# Altium schematic sheet PCB_V2.SchDoc
size A4; SheetNumber: 1; SheetTotal: 1
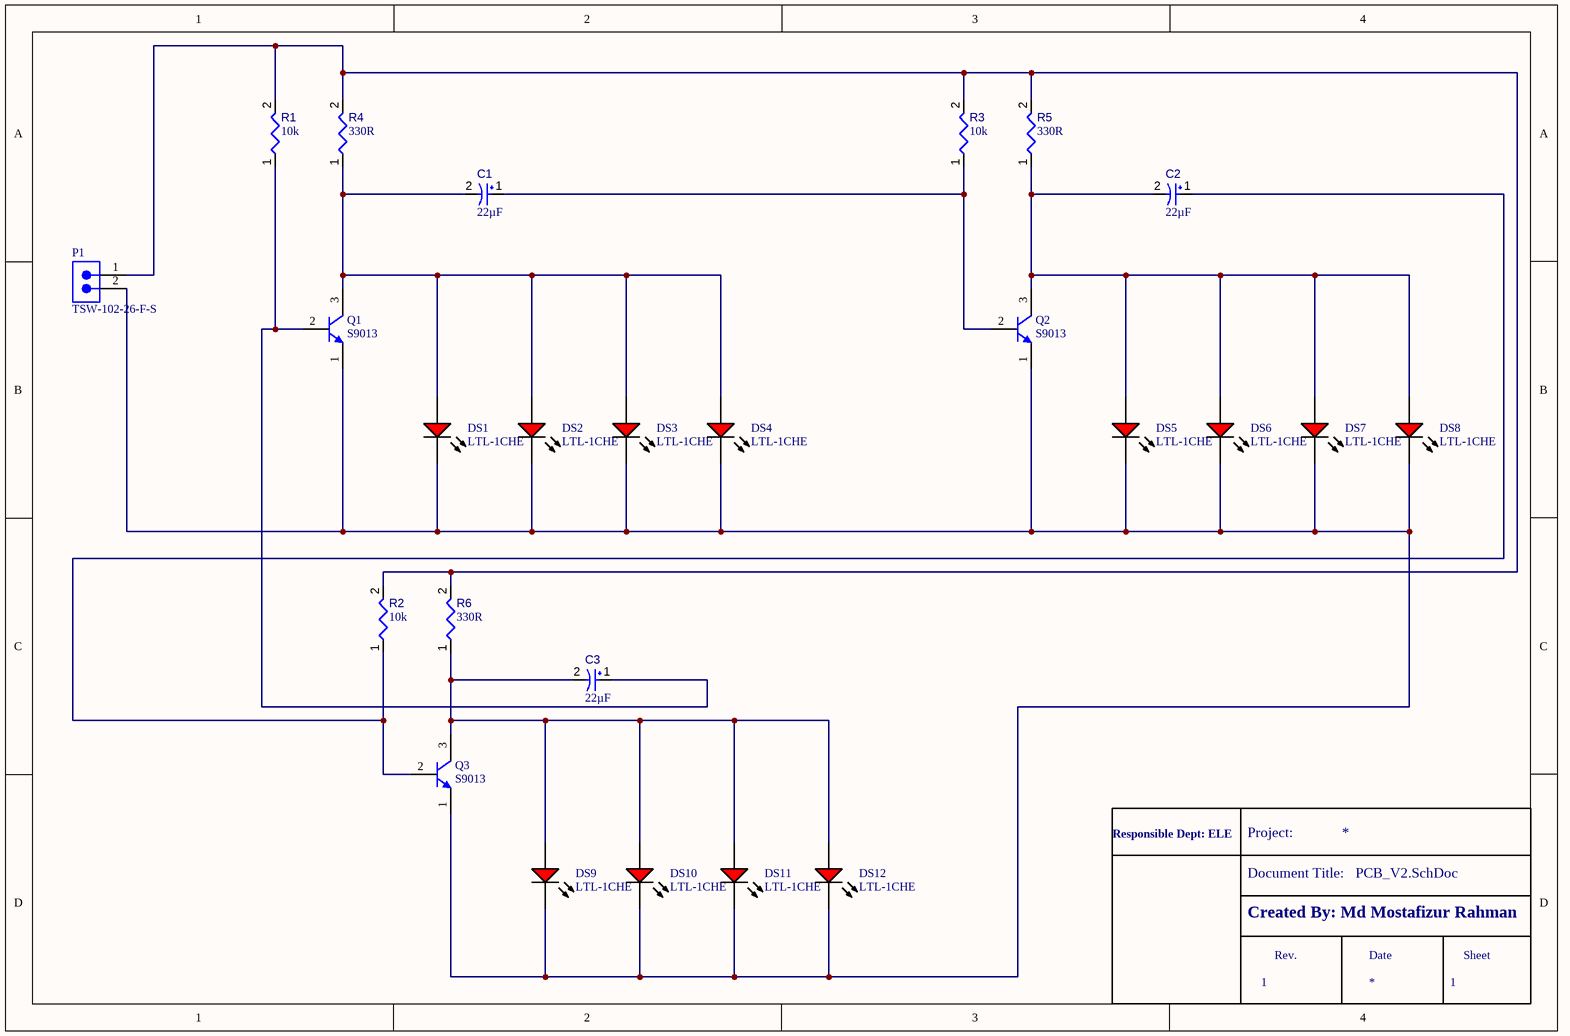
[diagram p0: PCB_V2.SchDoc]

## Parts
*  HSHL Title Block  (value not drawn)  (graphical)
C1  value 22µF  [CAPPR55-200-1100X500X1200]  (hidden comment: ECA1HM220)
C2  value 22µF  [CAPPR55-200-1100X500X1200]  (hidden comment: ECA1HM220)
C3  value 22µF  [CAPPR55-200-1100X500X1200]  (hidden comment: ECA1HM220)
DS1  LTL-1CHE  [INDPR60-254-520X380X650]
DS2  LTL-1CHE  [INDPR60-254-520X380X650]
DS3  LTL-1CHE  [INDPR60-254-520X380X650]
DS4  LTL-1CHE  [INDPR60-254-520X380X650]
DS5  LTL-1CHE  [INDPR60-254-520X380X650]
DS6  LTL-1CHE  [INDPR60-254-520X380X650]
DS7  LTL-1CHE  [INDPR60-254-520X380X650]
DS8  LTL-1CHE  [INDPR60-254-520X380X650]
DS9  LTL-1CHE  [INDPR60-254-520X380X650]
DS10  LTL-1CHE  [INDPR60-254-520X380X650]
DS11  LTL-1CHE  [INDPR60-254-520X380X650]
DS12  LTL-1CHE  [INDPR60-254-520X380X650]
P1  TSW-102-26-F-S  [SMTC-TSW-102-26-XX-S]
Q1  S9013  [JSCJ-TO-92-3_V]
Q2  S9013  [JSCJ-TO-92-3_V]
Q3  S9013  [JSCJ-TO-92-3_V]
R1  value 10k  [RESA60-630X240]  (hidden comment: MFR-25FBF52-10K)
R2  value 10k  [RESA60-630X240]  (hidden comment: MFR-25FBF52-10K)
R3  value 10k  [RESA60-630X240]  (hidden comment: MFR-25FBF52-10K)
R4  value 330R  [RESA60-630X240]  (hidden comment: MFR-25FBF52-10K)
R5  value 330R  [RESA60-630X240]
R6  330R  [RESA60-630X240]

## Nets
NetC1_1: C1.1 Q2.2(B) R3.1
NetC1_2: C1.2 DS1.1(A) DS2.1(A) DS3.1(A) DS4.1(A) Q1.3(C) R4.1
NetC2_1: C2.1 Q3.2(B) R2.1
NetC2_2: C2.2 DS5.1(A) DS6.1(A) DS7.1(A) DS8.1(A) Q2.3(C) R5.1
NetC3_1: C3.1 Q1.2(B) R1.1
NetC3_2: C3.2 DS9.1(A) DS10.1(A) DS11.1(A) DS12.1(A) Q3.3(C) R6.1
NetDS1_2: DS1.2(K) DS2.2(K) DS3.2(K) DS4.2(K) DS5.2(K) DS6.2(K) DS7.2(K) DS8.2(K) DS9.2(K) DS10.2(K) DS11.2(K) DS12.2(K) P1.2 Q1.1(E) Q2.1(E) Q3.1(E)
NetP1_1: P1.1 R1.2 R2.2 R3.2 R4.2 R5.2 R6.2

## Notes on the sheet
- (in symbol HSHL Title Block) Responsible Dept: ELE; Project:; Document Title:; Created By: Md Mostafizur Rahman; Rev.; Date; Sheet; 1

## Library data of the parts
C1-C3 = CMP-001-00027-7: Aluminum Electrolytic Capacitor, 22 uF, +/- 20%, 50 V, -40 to 85 degC, 2-Pin THD, RoHS, Bulk; Manufacturer: Panasonic; Ripple Current (AC): 100mA; Voltage Rating: 50V; Pins: 2; Case/Package: Radial; Datasheet Version: Rev. 05, 10/2016; RoHS Compliant: True; Max Operating Temperature: 85°C; Ripple Current: 100mA; Capacitor Type: Electrolytic; Mounting Technology: TH; Package Quantity: 200; Package Reference: CAPPR55-200-1100X500X1200; Package Description: 2-Pin Radial Lead, Dia 5 mm, Height 12 mm; Packaging: Bulk; Lead Pitch: 2mm; Min Operating Temperature: -40°C; Diameter: 5mm; Tolerance: 20%; Datasheet URL: https://industrial.panasonic.com/cdbs/www-data/pdf/RDF0000/ABA0000C1218.pdf; Manufacturer URL: http://www.panasonic.com/
DS1-DS12 = CMP-007-00018-2: LED Uni-Color Red, 100 mW, 30 mA, -55 to 100 degC, 2-Pin THD, RoHS, Bulk; Manufacturer: Lite-On; Forward Current: 20mA; Nominal Vf: 2V; Viewing Angle: 60degrees; Luminous Intensity: 12.6mcd; Lens Style: Dome; Pins: 2; RoHS Compliant: True; Package Reference: LTL-1CHE; Package Quantity: 1000; Mounting Technology: TH; Min Operating Temperature: -55°C; Colour: Red; Case/Package: Radial; Manufacturer URL: http://www.us.liteon.com/; Datasheet URL: https://datasheet.ciiva.com/15117/getdatasheetpartid-187746-15117985.pdf; Forward Voltage: 2V; Max Operating Temperature: 100°C; Illumination Colour: Red; Package Description: 2-Pin Through Hole Device, Dia 3.8 mm, Pitch 2.54 mm; Packaging: Bulk; Datasheet Version: Dec-03
P1 = CMP-1024-00329-1: 0.025" SQ Post Header, Through-hole, Vertical, -55 to 125 degC, 2.54 mm Pitch, 2-Pin, Male, RoHS; Manufacturer: Samtec; Pitch: 2.54 mm; PackageVersion: DM, 8/1988; ComponentLink2Description: Datasheet; PackageReference: TSW-102-26-XX-S; ComponentLink3URL: http://www.samtec.com/documents/webfiles/cpdf/TSW-XXX-XX-XXX-X-XX-XXX-MKT.pdf; ComponentLink2URL: http://www.samtec.com/documents/webfiles/pdf/TSW_TH.PDF; ComponentLink1Description: Manufacturer URL; DatasheetVersion: F-214; RoHS: True; ComponentLink3Description: Package Specification; PartNumber: TSW-102-26-F-S; Temperature Range: -55 to 125 degC; Orientation: Vertical; ComponentLink1URL: http://www.samtec.com; PackageDescription: .025[0.64] SQ. Post Terminal Strip Assembly; Mounting Technology: Through-hole
Q1-Q3 = CMP-013-00000-3: Transistor, NPN, 0.1 uA, 150 MHz, 3-Pin TO-92; Manufacturer: Jiangsu Changjiang Electronics Technology; Case/Package: TO-92-3; Datasheet URL: http://www.cj-elec.com/txUpfile/20121910315050632.pdf; Datasheet Version: Rev. B, 11/2011; Package Description: 3-Pin Through Hole Device, Height 4.7 mm, Pitch 2.3 mm; Mounting Technology: TH; RoHS Compliant: False; Package Reference: TO-92-3
R1-R6 = CMP-009-00047-4: Axial Resistor, 10 KOhm, +/- 1%, 0.25 W, -55 to 155 degC, 2-Pin THD, RoHS, Bulk; Manufacturer: Yageo; Power: 250mW; Voltage Rating: 250V; Manufacturer URL: http://www.yageo.com/; Datasheet URL: http://www.yageo.com/documents/recent/Yageo%20LR_MFR_2013.pdf; Package Reference: MFR-25; Min Operating Temperature: -55°C; Mounting Technology: TH; Package Quantity: 200; Case/Package: Axial; Tolerance: 1%; RoHS Compliant: True; Datasheet Version: Apr-13; Packaging: Bulk; Max Operating Temperature: 155°C; Package Description: 2-Pin Axial Lead, Dia 2.4 mm, Body Length 6.3 mm
  R6: Value: 330R